# Altium project ESP32_Tang1.PrjPcb (part 2 of 2)

## Sheet USB.SchDoc
size A; SheetNumber: 2; SheetTotal: 13
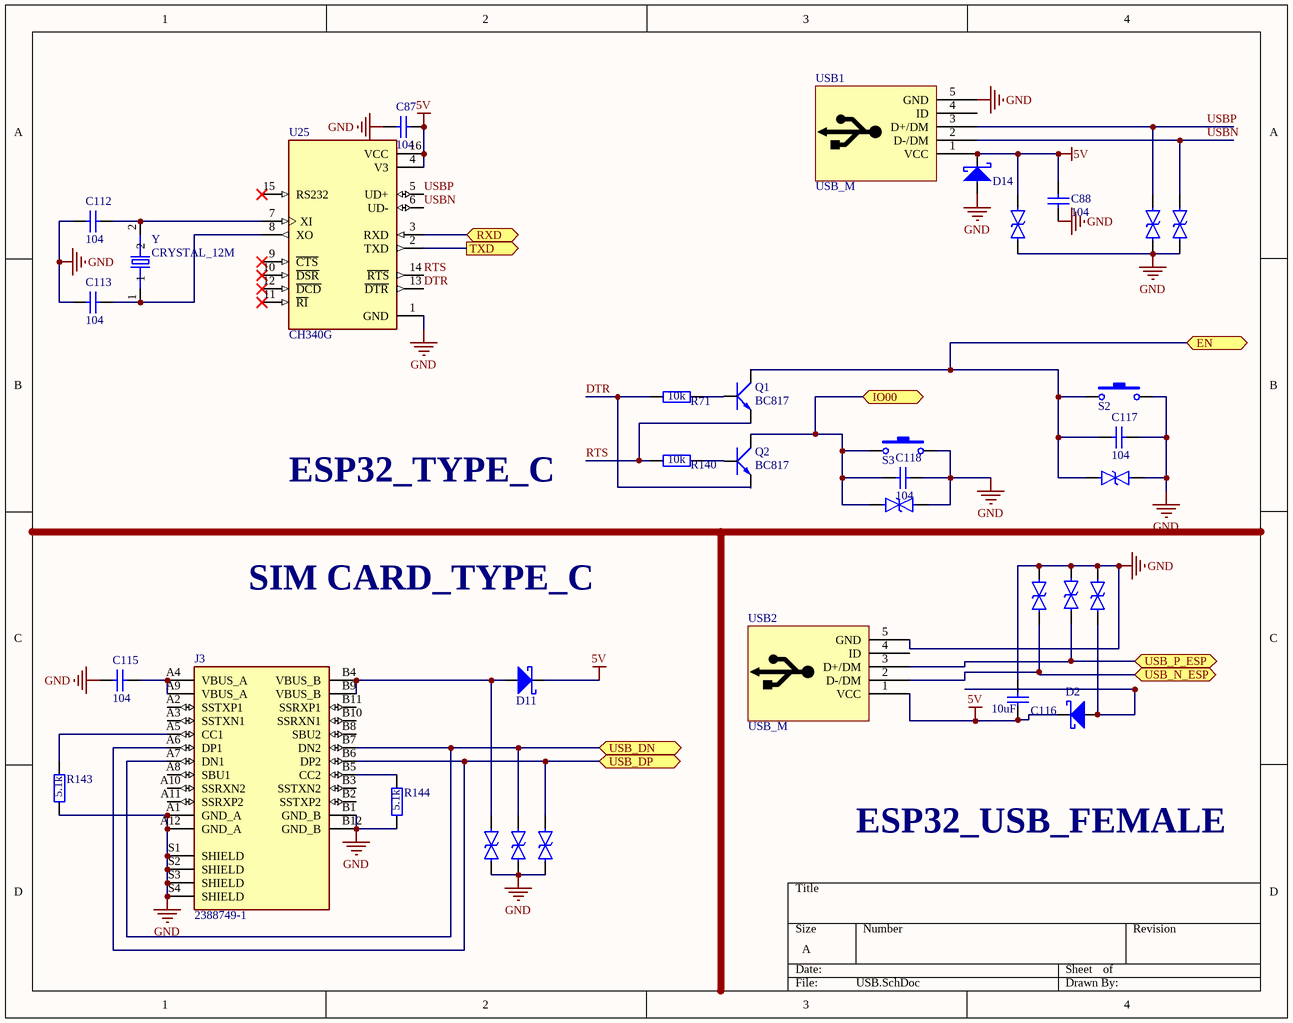
[diagram p12: USB.SchDoc]

### Parts
C87  104  [0603_Cap]
C88  104  [0603_Cap]
C112  104  [0603_Cap]
C113  104  [0603_Cap]
C115  104  [0603_Cap]
C116  10uF  [1206_CAP]
C117  104  [0603_Cap]
C118  104  [0603_Cap]
D2  SS24  [DIO-SMD-106]  (value not drawn)
D11  SS24  [DIO-SMD-106]  (value not drawn)
D14  SS24  [DIO-SMD-106]  (value not drawn)
J3  2388749-1  [USBC]
Q1  BC817  [SOT-23]
Q2  BC817  [SOT-23]
R71  10k  [0603_Res]
R140  10k  [0603_Res]
R143  5.1k  [0603_Res]
R144  5.1k  [0603_Res]
S2  SW  [BUTTON-SMD 2PIN]  (value not drawn)
S3  SW  [BUTTON-SMD 2PIN]  (value not drawn)
TVS5  SMBJ12CA  [SMB - DO-214AA]  (value not drawn)
TVS6  SMBJ12CA  [SMB - DO-214AA]  (value not drawn)
TVS9  SMBJ12CA  [SMB - DO-214AA]  (value not drawn)
TVS10  SMBJ12CA  [SMB - DO-214AA]  (value not drawn)
TVS11  SMBJ12CA  [SMB - DO-214AA]  (value not drawn)
TVS12  SMBJ12CA  [SMB - DO-214AA]  (value not drawn)
TVS18  SMBJ12CA  [SMB - DO-214AA]  (value not drawn)
TVS19  SMBJ12CA  [SMB - DO-214AA]  (value not drawn)
TVS20  SMBJ12CA  [SMB - DO-214AA]  (value not drawn)
TVS26  SMBJ12CA  [SMB - DO-214AA]  (value not drawn)
TVS27  SMBJ12CA  [SMB - DO-214AA]  (value not drawn)
U25  CH340G  [SOIC127P600X180-16N]
USB1  USB_M  [USB-M1]
USB2  USB_M  [USB-M1]
Y  CRYSTAL_12M  [XTAL1170X500X450]

### Ports
EN (bidir), IO00 (bidir), RXD (bidir), TXD (out), USB_DN (bidir), USB_DP (bidir), USB_N_ESP (bidir), USB_P_ESP (bidir)

### Nets
5V: C87.2 C88.1 C116.2 D2.2 D11.2 D14.2 TVS5.2 U25.4(V3) U25.16(VCC) USB1.1(VCC) USB2.1(VCC)
GND: C87.1 C88.2 C112.2 C113.2 C115.1 C116.1 C117.1 C118.1 D14.1 J3.A1(GND_A) J3.A12(GND_A) J3.B1(GND_B) J3.B12(GND_B) J3.S1(SHIELD) J3.S2(SHIELD) J3.S3(SHIELD) J3.S4(SHIELD) R143.1 R144.1 S2.2 S3.2 TVS5.1 TVS6.1 TVS9.1 TVS10.1 TVS11.1 TVS12.1 TVS18.1 TVS19.1 TVS20.1 TVS26.1 TVS27.1 U25.1(GND) USB1.5(GND) USB2.5(GND)
DTR: Q2.2(E) R71.1 U25.13(~{DTR})
EN: C117.2 Q1.3(C) S2.1 TVS26.2 ; port EN
IO00: C118.2 Q2.3(C) S3.1 TVS27.2 ; port IO00
RTS: Q1.2(E) R140.1 U25.14(~{RTS})
UART0_RX_ESP32: U25.2(TXD) ; port TXD
UART0_TX_ESP32: U25.3(RXD) ; port RXD
USB_DN: J3.A7(DN1) J3.B7(DN2) TVS19.2 ; port USB_DN
USB_DP: J3.A6(DP1) J3.B6(DP2) TVS20.2 ; port USB_DP
USB_N_ESP: TVS10.2 USB2.2(D-/DM) ; port USB_N_ESP
USB_P_ESP: TVS11.2 USB2.3(D+/DM) ; port USB_P_ESP
USBN: TVS9.2 U25.6(UD-) USB1.2(D-/DM)
USBP: TVS6.2 U25.5(UD+) USB1.3(D+/DM)
NetC112_1: C112.1 U25.7(XI) Y.2
NetC113_1: C113.1 U25.8(XO) Y.1
NetC115_2: C115.2 J3.A4(VBUS_A) J3.A9(VBUS_A)
NetD2_1: D2.1 TVS12.2
NetD11_1: D11.1 J3.B4(VBUS_B) J3.B9(VBUS_B) TVS18.2
NetJ3_A5: J3.A5(CC1) R143.2
NetJ3_B5: J3.B5(CC2) R144.2
NetQ1_1: Q1.1(B) R71.2
NetQ2_1: Q2.1(B) R140.2

Not connected (* = marked no-connect by the designer): J3 A2(SSTXP1) A3(SSTXN1) A8(SBU1) A10(SSRXN2) A11(SSRXP2) B2(SSTXP2) B3(SSTXN2) B8(SBU2) B10(SSRXN1) B11(SSRXP1); U25 9(~{CTS})* 10(~{DSR})* 11(~{RI})* 12(~{DCD})* 15(RS232)*; USB1 4(ID); USB2 4(ID)

### Notes on the sheet
- ESP32_TYPE_C
- SIM CARD_TYPE_C
- ESP32_USB_FEMALE

### Library data of the parts
C87 C88 C112 C113 C115-C118 = Ceramic Capacitor: Chung_Loai: Dán; Don_Vi: Con; So_Chan: 2; Ten_Linh_Kien: Tụ 0805 104-100nF 10% 50V; Ma_Hang: MH004551; Kieu_Chan: *
D2 D11 D14 = Diode Schottky: Part Number: LED 3 ly Single Colour; Pricing: *
J3 = 2388749-1: USB-C (USB TYPE-C) USB 4.0 Receptacle Connector 24 Position Surface Mount, Right Angle; Through Hole; MF: TE Connectivity; Value: *; SnapEDA_Link: https://www.snapeda.com/parts/2388749-1/TE+Connectivity/view-part/?ref=snap; Purchase-URL: https://pricing.snapeda.com/search/part/2388749-1/?ref=eda; Availability: In Stock; Price: None; Package: None; Check_prices: https://www.snapeda.com/parts/2388749-1/TE+Connectivity/view-part/?ref=eda; MP: 2388749-1
Q1 Q2 = Trans BC817: SOT-23 - C8658; Value: C9014
R71 R140 R143 R144 = Resistor: Chung_Loai: Dán; Don_Vi: Con; So_Chan: 2; Ten_Linh_Kien: Trở 0805 1% 1k; Ma_Hang: MH005468; Kieu_Chan: *
S2 S3 = SW-Button: Switch-Button; Published: 24-Mar-1999; LatestRevisionDate: 17-Jul-2002; LatestRevisionNote: Re-released for DXP Platform.; PackageReference: SPST-2; Publisher: Altium Limited
TVS5 TVS6 TVS9-TVS12 TVS18-TVS20 TVS26 TVS27 = TVS Bi Diode
U25 = CH340G: USB Interface Integrated Circuit; MF: WCH; Value: *; SnapEDA_Link: https://www.snapeda.com/parts/Ch340G/WCH/view-part/?ref=snap; MP: Ch340G; Check_prices: https://www.snapeda.com/parts/Ch340G/WCH/view-part/?ref=eda; Availability: Not in stock; Price: None; Package: None
Y = CRYSTAL_12M: HC49SDLF Series 12.288 MHz Â±30 ppm 20 pF -20 to +70 Â°C Resistance Weld Crystal; MF: Fox Electronics; MP: FOXSDLF/128-20/TR; Price: None; Package: None; Availability: Unavailable; Value: *; SnapEDA_Link: https://www.snapeda.com/parts/FOXSDLF/128-20/TR/Fox%20Electronics/view-part/1118363/?ref=snap

## Nets that join several sheets
3V3_485: POWER (C38.1 C74.1 U5.2 U5.4), RS485 (C56.1 L5.1 R83.2 R84.2), RS232 (R75.2 R76.2)
3V3_ETHERNET_SD: ETHERNET (U21.10 U21.11), POWER (C26.1 C28.1 U8.2 U8.4), SD_card (6 pins)
3V3_MCU_ESP: IoT_Board_ESP32 (10 pins), POWER (C18.1 C20.1 U6.2 U6.4)
3V3_MCU_STM: IoT_Board_ESP32 (20 pins), POWER (C78.1 C80.1 U22.2 U22.4)
3V3_RTC: RTC (6 pins), DI (14 pins), POWER (C22.1 C24.1 U7.2 U7.4)
5V: IoT_Board_ESP32 (11 pins), POWER (28 pins), DO (15 pins), AI (9 pins), RS232 (C52.1 L4.1), USB (11 pins)
24V: IoT_Board_ESP32 (P2.1), DI (JP3.1 JP4.1), POWER (C13.1 F1.1 VR1.1), DO (12 pins)
+12V: POWER (8 pins), AI (15 pins)
-12V: IoT_Board_ESP32 (6 pins), POWER (C47.1 C67.2 ICL1.5), AI (10 pins)
AGND: IoT_Board_ESP32 (P4.5 P4.7), AI (45 pins)
BUZZER_POWER: POWER (C82.1 C84.1 U23.2 U23.4), BUZZER (D22.2 LS1.P)
GND: IoT_Board_ESP32 (51 pins), RTC (12 pins), ETHERNET (U21.1 U21.2 U21.12), POWER (64 pins), RS485 (C56.2 C57.2 U20.2), SD_card (C48.2 P1.0 P1.6), DO (27 pins), SIM_CARD (25 pins), BUZZER (Q3.1), RS232 (C52.2 C53.2 R74.1 U19.2), USB (35 pins)
i_GND: DI (16 pins), DO (13 pins)
MAIN: POWER (C30.1 C32.1 R6.2 U9.2), SIM_CARD (J2.2 J2.39 J2.41 J2.52)
AIN5: IoT_Board_ESP32 (P4.4), AI (R116.1 U28.4)
AIN6: IoT_Board_ESP32 (P4.3), AI (R119.1 U28.5)
AIN7: IoT_Board_ESP32 (P4.2), AI (R117.1 U28.7)
AIN8: IoT_Board_ESP32 (P4.1), AI (R118.1 U28.6)
DI1: IoT_Board_ESP32 (U3.20), DI (C36.1 L10.2 R20.1 U10.10)
DI2: IoT_Board_ESP32 (U3.46), DI (C35.1 L9.2 R16.1 U10.12)
DI3: IoT_Board_ESP32 (U3.25), DI (C34.1 L8.2 R12.1 U10.14)
DI4: IoT_Board_ESP32 (U3.26), DI (C33.1 L7.2 R8.1 U10.16)
DI5: IoT_Board_ESP32 (U3.27), DI (C37.1 L16.2 R42.1 U11.10)
DI6: IoT_Board_ESP32 (U3.28 U3.29), DI (C12.1 L12.2 R28.1 U11.12)
DO1: IoT_Board_ESP32 (U1.23), DO (C40.1 R35.1 R36.2)
DO2: IoT_Board_ESP32 (U1.28), DO (C42.1 R45.1 R46.2)
DO3: IoT_Board_ESP32 (U1.29), DO (C43.1 R52.1 R54.2)
DO4: IoT_Board_ESP32 (U1.30), DO (C44.1 R53.1 R56.2)
DO5: IoT_Board_ESP32 (U1.31), DO (C39.1 R32.1 R33.2)
DO6: IoT_Board_ESP32 (U1.32), DO (C85.1 R94.1 R96.2)
DO7: IoT_Board_ESP32 (U1.33), DO (C86.1 R95.1 R98.2)
DO8: IoT_Board_ESP32 (U1.34), DO (C75.1 R38.1 R40.2)
DO9: IoT_Board_ESP32 (U1.35), DO (C76.1 R39.1 R50.2)
EN: IoT_Board_ESP32 (H1.2 U1.3), USB (C117.2 Q1.3 S2.1 TVS26.2)
ETHERNET_nINT: IoT_Board_ESP32 (U1.24), ETHERNET (U21.6)
ETHERNET_nRESET: IoT_Board_ESP32 (U1.16), ETHERNET (U21.8)
I2C_SCL_ESP: IoT_Board_ESP32 (R3.1 U1.17), RTC (IC1.16), SIM_CARD (J2.30 TP5.TP)
I2C_SCL_STM: IoT_Board_ESP32 (R86.1 U3.42), AI (U28.9 U28.10 U33.9 U33.10)
I2C_SDA_ESP: IoT_Board_ESP32 (R4.1 U1.12), RTC (IC1.15), SIM_CARD (J2.32 TP6.TP)
IO00: IoT_Board_ESP32 (H1.3 U1.27), USB (C118.2 Q2.3 S3.1 TVS27.2)
IO01: IoT_Board_ESP32 (U1.39), SIM_CARD (J2.6)
IO02: IoT_Board_ESP32 (U1.38), SIM_CARD (J2.22 TP4.TP)
IO03: IoT_Board_ESP32 (U1.15), SIM_CARD (J2.44)
IO04: IoT_Board_ESP32 (U1.4), SIM_CARD (J2.46)
IO05: IoT_Board_ESP32 (U1.5), SIM_CARD (J2.48 TP7.TP)
IO06: IoT_Board_ESP32 (U1.6), SIM_CARD (J2.31)
IO07: IoT_Board_ESP32 (U1.7), SIM_CARD (J2.33)
IO14: IoT_Board_ESP32 (U1.22), SIM_CARD (J2.42)
IO45: IoT_Board_ESP32 (U1.26), BUZZER (R139.1)
NetC91_2: IoT_Board_ESP32 (P4.10), AI (C91.2 C92.1 R130.1 TVS22.1)
NetC96_1: IoT_Board_ESP32 (P4.9), AI (C96.1 C97.2 R132.1 TVS23.2)
NetC104_1: IoT_Board_ESP32 (P4.8), AI (C104.1 R137.1 TVS24.1)
NetC109_1: IoT_Board_ESP32 (P4.6), AI (C109.1 R138.1 TVS25.1)
NetD1_2: IoT_Board_ESP32 (H25.3), DO (D1.2 Q7.1 R59.2)
NetD6_2: IoT_Board_ESP32 (H25.4), DO (D6.2 Q10.1 R61.2)
NetD12_2: IoT_Board_ESP32 (H25.1), DO (D12.2 Q11.1 R101.2)
NetD13_2: IoT_Board_ESP32 (H25.2), DO (D13.2 Q12.1 R103.2)
NetH2_1: IoT_Board_ESP32 (H2.1), DI (R48.2 U11.8)
NetH2_2: IoT_Board_ESP32 (H2.2), DI (R31.2 U11.6)
NetH2_3: IoT_Board_ESP32 (H2.3), DI (R27.2 U11.4)
NetP3_1: IoT_Board_ESP32 (P3.1), DI (R23.2 U10.8)
NetP3_2: IoT_Board_ESP32 (P3.2), DI (R19.2 U10.6)
NetP3_3: IoT_Board_ESP32 (P3.3), DI (R15.2 U10.4)
NetP3_4: IoT_Board_ESP32 (P3.4), DI (R11.2 U10.2)
PA11: IoT_Board_ESP32 (U3.32), AI (R114.1 U28.2)
PA12: IoT_Board_ESP32 (U3.33), AI (R135.1 U33.2)
RS485_A: IoT_Board_ESP32 (H7.2), RS485 (F4.2 H24.1)
RS485_B: IoT_Board_ESP32 (H7.1), RS485 (F5.2 R81.2)
RS485_GND: IoT_Board_ESP32 (H7.3), RS485 (5 pins)
SPI_CS1_ESP32: IoT_Board_ESP32 (U1.18), SD_card (P1.1 R1.1)
SPI_CS2_ESP32: IoT_Board_ESP32 (U1.25), ETHERNET (U21.5)
SPI_MISO_ESP32: IoT_Board_ESP32 (U1.21), ETHERNET (U21.7), SD_card (P1.7 R66.1)
SPI_MOSI_ESP32: IoT_Board_ESP32 (U1.19), ETHERNET (U21.3), SD_card (P1.2 R2.1)
SPI_SCK_ESP32: IoT_Board_ESP32 (U1.20), ETHERNET (U21.4), SD_card (P1.5 R65.1)
U0CTS: IoT_Board_ESP32 (U1.9), SIM_CARD (J2.13 TP2.TP)
U0RTS: IoT_Board_ESP32 (U1.8), SIM_CARD (J2.11 TP1.TP)
UART0_RX_ESP32: IoT_Board_ESP32 (H1.4 U1.36), USB (U25.2)
UART0_TX_ESP32: IoT_Board_ESP32 (H1.5 U1.37), USB (U25.3)
UART1_RX_ESP32: IoT_Board_ESP32 (U1.11), SIM_CARD (J2.19)
UART1_RX_STM32: IoT_Board_ESP32 (U3.31), RS232 (L23.2 U19.3)
UART1_TX_ESP32: IoT_Board_ESP32 (U1.10), SIM_CARD (J2.17)
UART1_TX_STM32: IoT_Board_ESP32 (U3.30), RS232 (R73.1 R74.2)
UART2_RX_STM32: IoT_Board_ESP32 (U3.13), RS485 (L25.2 R79.1)
UART2_TX_STM32: IoT_Board_ESP32 (U3.12), RS485 (L26.2 R80.1)
USB_DN: SIM_CARD (J2.36), USB (J3.A7 J3.B7 TVS19.2)
USB_DP: SIM_CARD (J2.38), USB (J3.A6 J3.B6 TVS20.2)
USB_N_ESP: IoT_Board_ESP32 (U1.13), USB (TVS10.2 USB2.2)
USB_P_ESP: IoT_Board_ESP32 (U1.14), USB (TVS11.2 USB2.3)